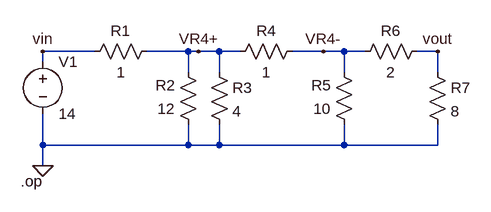
[diagram p0: schematic Draft1.asc]
Draft1.asc, the LTspice schematic file:
Version 4
SHEET 1 880 680
WIRE 128 128 48 128
WIRE 272 128 208 128
WIRE 288 128 272 128
WIRE 320 128 288 128
WIRE 352 128 320 128
WIRE 480 128 432 128
WIRE 512 128 480 128
WIRE 544 128 512 128
WIRE 656 128 624 128
WIRE 48 144 48 128
WIRE 272 160 272 128
WIRE 320 160 320 128
WIRE 512 160 512 128
WIRE 656 160 656 128
WIRE 48 272 48 224
WIRE 272 272 272 240
WIRE 272 272 48 272
WIRE 320 272 320 240
WIRE 320 272 272 272
WIRE 512 272 512 240
WIRE 512 272 320 272
WIRE 656 272 656 240
WIRE 656 272 512 272
WIRE 48 304 48 272
FLAG 48 304 0
FLAG 48 128 vin
FLAG 656 128 vout
FLAG 288 128 VR4+
FLAG 480 128 VR4-
DATAFLAG 384 80 "V(vr4+)-V(vr4-)"
SYMBOL voltage 48 128 R0
WINDOW 123 0 0 Left 0
WINDOW 39 0 0 Left 0
SYMATTR InstName V1
SYMATTR Value 14
SYMBOL res 224 112 R90
WINDOW 0 0 56 VBottom 2
WINDOW 3 32 56 VTop 2
SYMATTR InstName R1
SYMATTR Value 1
SYMBOL res 288 256 R180
WINDOW 0 36 76 Left 2
WINDOW 3 36 40 Left 2
SYMATTR InstName R2
SYMATTR Value 12
SYMBOL res 304 144 R0
SYMATTR InstName R3
SYMATTR Value 4
SYMBOL res 448 112 R90
WINDOW 0 0 56 VBottom 2
WINDOW 3 32 56 VTop 2
SYMATTR InstName R4
SYMATTR Value 1
SYMBOL res 528 256 R180
WINDOW 0 36 76 Left 2
WINDOW 3 36 40 Left 2
SYMATTR InstName R5
SYMATTR Value 10
SYMBOL res 528 144 R270
WINDOW 0 32 56 VTop 2
WINDOW 3 0 56 VBottom 2
SYMATTR InstName R6
SYMATTR Value 2
SYMBOL res 640 144 R0
SYMATTR InstName R7
SYMATTR Value 8
TEXT 14 328 Left 2 !.op

The netlist it stands for:
* Draft1.asc
V1 vin 0 14
R1 VR4+ vin 1
R2 0 VR4+ 12
R3 VR4+ 0 4
R4 VR4- VR4+ 1
R5 0 VR4- 10
R6 VR4- vout 2
R7 vout 0 8
.op
.backanno
.end